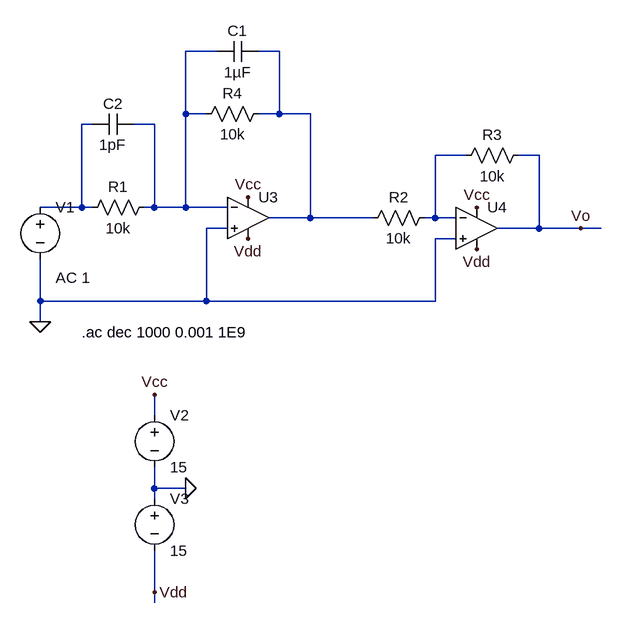
[diagram p0: schematic taller9_compensador.asc]
taller9_compensador.asc, the LTspice schematic file:
Version 4.1
SHEET 1 964 756
WIRE 96 -144 48 -144
WIRE 192 -144 160 -144
WIRE 48 -48 48 -144
WIRE 80 -48 48 -48
WIRE 192 -48 192 -144
WIRE 192 -48 160 -48
WIRE 240 -48 192 -48
WIRE -96 -32 -112 -32
WIRE 0 -32 -32 -32
WIRE 480 16 432 16
WIRE 592 16 560 16
WIRE -112 96 -112 -32
WIRE -112 96 -176 96
WIRE -96 96 -112 96
WIRE 0 96 0 -32
WIRE 0 96 -16 96
WIRE 48 96 48 -48
WIRE 48 96 0 96
WIRE 112 96 48 96
WIRE 240 112 240 -48
WIRE 240 112 176 112
WIRE 336 112 240 112
WIRE 432 112 432 16
WIRE 432 112 416 112
WIRE 464 112 432 112
WIRE 112 128 80 128
WIRE 592 128 592 16
WIRE 592 128 528 128
WIRE 656 128 592 128
WIRE 688 128 656 128
WIRE 464 144 432 144
WIRE -176 240 -176 176
WIRE 80 240 80 128
WIRE 80 240 -176 240
WIRE 432 240 432 144
WIRE 432 240 80 240
WIRE -176 272 -176 240
WIRE 0 416 0 384
WIRE 0 528 0 496
WIRE 48 528 0 528
WIRE 0 544 0 528
WIRE 0 688 0 624
WIRE 0 704 0 688
FLAG 144 80 Vcc
FLAG 496 96 Vcc
FLAG 144 144 Vdd
FLAG 496 160 Vdd
FLAG -176 272 0
FLAG 0 688 Vdd
FLAG 0 384 Vcc
FLAG 656 128 Vo
FLAG 48 528 0
SYMBOL res 0 80 R90
WINDOW 0 0 56 VBottom 2
WINDOW 3 32 56 VTop 2
SYMATTR InstName R1
SYMATTR Value 10k
SYMBOL res 432 96 R90
WINDOW 0 0 56 VBottom 2
WINDOW 3 32 56 VTop 2
SYMATTR InstName R2
SYMATTR Value 10k
SYMBOL res 576 0 R90
WINDOW 0 0 56 VBottom 2
WINDOW 3 32 56 VTop 2
SYMATTR InstName R3
SYMATTR Value 10k
SYMBOL res 176 -64 R90
WINDOW 0 0 56 VBottom 2
WINDOW 3 32 56 VTop 2
SYMATTR InstName R4
SYMATTR Value 10k
SYMBOL cap 160 -160 R90
WINDOW 0 0 32 VBottom 2
WINDOW 3 32 32 VTop 2
SYMATTR InstName C1
SYMATTR Value 1µF
SYMBOL voltage -176 80 R0
WINDOW 123 24 124 Left 2
WINDOW 39 0 0 Left 0
SYMATTR Value2 AC 1
SYMATTR InstName V1
SYMATTR Value ""
SYMBOL voltage 0 400 R0
SYMATTR InstName V2
SYMATTR Value 15
SYMBOL cap -32 -48 R90
WINDOW 0 0 32 VBottom 2
WINDOW 3 32 32 VTop 2
SYMATTR InstName C2
SYMATTR Value 1pF
SYMBOL voltage 0 528 R0
SYMATTR InstName V3
SYMATTR Value 15
SYMBOL OpAmps\\UniversalOpAmp2 144 112 R0
SYMATTR InstName U3
SYMATTR Value2 Avol=1Meg GBW=100G Slew=10Meg
SYMBOL OpAmps\\UniversalOpAmp2 496 128 R0
SYMATTR InstName U4
SYMATTR Value2 Avol=1Meg GBW=100G Slew=10Meg
TEXT -112 288 Left 2 !.ac dec 1000 0.001 1E9

The netlist it stands for:
* taller9_compensador.asc
R1 N001 N003 10k
R2 N004 N002 10k
R3 Vo N004 10k
R4 N002 N001 10k
C1 N002 N001 1µF
V1 N003 0 AC 1
V2 Vcc 0 15
C2 N001 N003 1pF
V3 0 Vdd 15
X§U3 0 N001 Vcc Vdd N002 level2 Avol=1Meg GBW=100G Slew=10Meg Ilimit=25m Rail=0 Vos=0 En=0 Enk=0 In=0 Ink=0 Rin=500Meg  ; pins In+ In- V+ V- OUT
X§U4 0 N004 Vcc Vdd Vo level2 Avol=1Meg GBW=100G Slew=10Meg Ilimit=25m Rail=0 Vos=0 En=0 Enk=0 In=0 Ink=0 Rin=500Meg  ; pins In+ In- V+ V- OUT
.ac dec 1000 0.001 1E9
.lib UniversalOpAmp2.lib
.backanno
.end